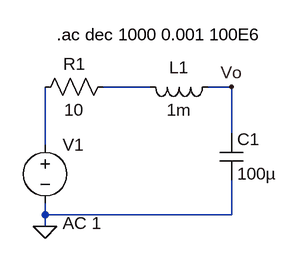
[diagram p0: schematic taller9.asc]
taller9.asc, the LTspice schematic file:
Version 4.1
SHEET 1 880 680
WIRE 240 48 176 48
WIRE 352 48 320 48
WIRE 352 112 352 48
WIRE 96 128 96 48
WIRE 96 224 96 208
WIRE 352 224 352 176
WIRE 352 224 96 224
WIRE 96 240 96 224
FLAG 96 240 0
FLAG 352 48 Vo
SYMBOL ind 336 32 R90
WINDOW 0 5 56 VBottom 2
WINDOW 3 32 56 VTop 2
SYMATTR InstName L1
SYMATTR Value 1m
SYMBOL res 192 32 R90
WINDOW 0 0 56 VBottom 2
WINDOW 3 32 56 VTop 2
SYMATTR InstName R1
SYMATTR Value 10
SYMBOL cap 336 112 R0
SYMATTR InstName C1
SYMATTR Value 100µ
SYMBOL voltage 96 112 R0
WINDOW 123 24 124 Left 2
WINDOW 39 0 0 Left 0
SYMATTR Value2 AC 1
SYMATTR InstName V1
SYMATTR Value ""
TEXT 112 -24 Left 2 !.ac dec 1000 0.001 100E6

The netlist it stands for:
* taller9.asc
L1 Vo N001 1m
R1 N001 N002 10
C1 Vo 0 100µ
V1 N002 0 AC 1
.ac dec 1000 0.001 100E6
.backanno
.end